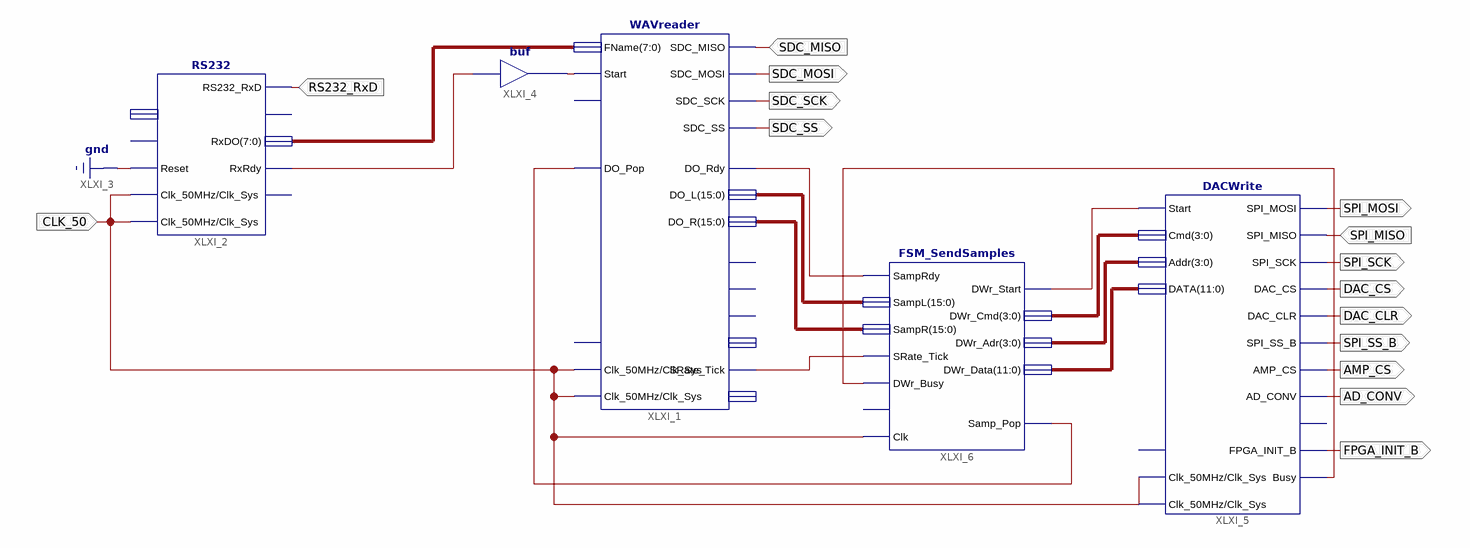
[diagram p0: schematic sheet 1]
// Xilinx ISE schematic mainSchematic.sch (spartan3e) as structural Verilog: 5 symbols, 15 ports
module mainSchematic (
  input  CLK_50,
  input  RS232_RxD,
  input  SDC_MISO,
  input  SPI_MISO,
  output SDC_MOSI,
  output SDC_SCK,
  output SDC_SS,
  output SPI_MOSI,
  output SPI_SCK,
  output DAC_CS,
  output DAC_CLR,
  output SPI_SS_B,
  output AMP_CS,
  output AD_CONV,
  output FPGA_INIT_B
);

  wire XLXN_7, XLXN_8, XLXN_25, XLXN_26, XLXN_29, XLXN_31, XLXN_35;
  wire [3:0] XLXN_32, XLXN_33;
  wire [7:0] XLXN_3;
  wire [11:0] XLXN_34;
  wire [15:0] XLXN_27, XLXN_28;

  WAVreader XLXI_1 (
    .FName(XLXN_3), .Start(XLXN_8), .SDC_MOSI(SDC_MOSI), .SDC_SCK(SDC_SCK), .SDC_SS(SDC_SS),
    .SDC_MISO(SDC_MISO), .DO_Pop(XLXN_35), .SRate_Tick(XLXN_29), .Clk_50MHz(CLK_50), .Clk_Sys(CLK_50),
    .DO_Rdy(XLXN_26), .DO_L(XLXN_27), .DO_R(XLXN_28));  // open: Abort, FmtMnS, Fmt8n16, FmtSRate, Error, Reset, Busy
  RS232 XLXI_2 (
    .Clk_50MHz(CLK_50), .Reset(1'b0), .RS232_RxD(RS232_RxD), .RxRdy(XLXN_7), .RxDO(XLXN_3), .Clk_Sys(CLK_50));  // open: TxStart, TxDI, TxBusy, RS232_TxD
  buf XLXI_4 (XLXN_8, XLXN_7);
  DACWrite XLXI_5 (
    .Start(XLXN_31), .SPI_MISO(SPI_MISO), .Cmd(XLXN_32), .Addr(XLXN_33), .DATA(XLXN_34), .DAC_CLR(DAC_CLR),
    .DAC_CS(DAC_CS), .SPI_MOSI(SPI_MOSI), .SPI_SCK(SPI_SCK), .SPI_SS_B(SPI_SS_B), .AMP_CS(AMP_CS),
    .AD_CONV(AD_CONV), .FPGA_INIT_B(FPGA_INIT_B), .Busy(XLXN_25), .Clk_50MHz(CLK_50), .Clk_Sys(CLK_50));  // open: Reset, SF_CE0
  FSM_SendSamples XLXI_6 (
    .Clk(CLK_50), .SRate_Tick(XLXN_29), .SampRdy(XLXN_26), .DWr_Busy(XLXN_25), .SampL(XLXN_27),
    .SampR(XLXN_28), .Samp_Pop(XLXN_35), .DWr_Start(XLXN_31), .DWr_Cmd(XLXN_32), .DWr_Adr(XLXN_33),
    .DWr_Data(XLXN_34));  // open: Reset
endmodule
